# EAGLE design ramboard (EAGLE 6.6.0)
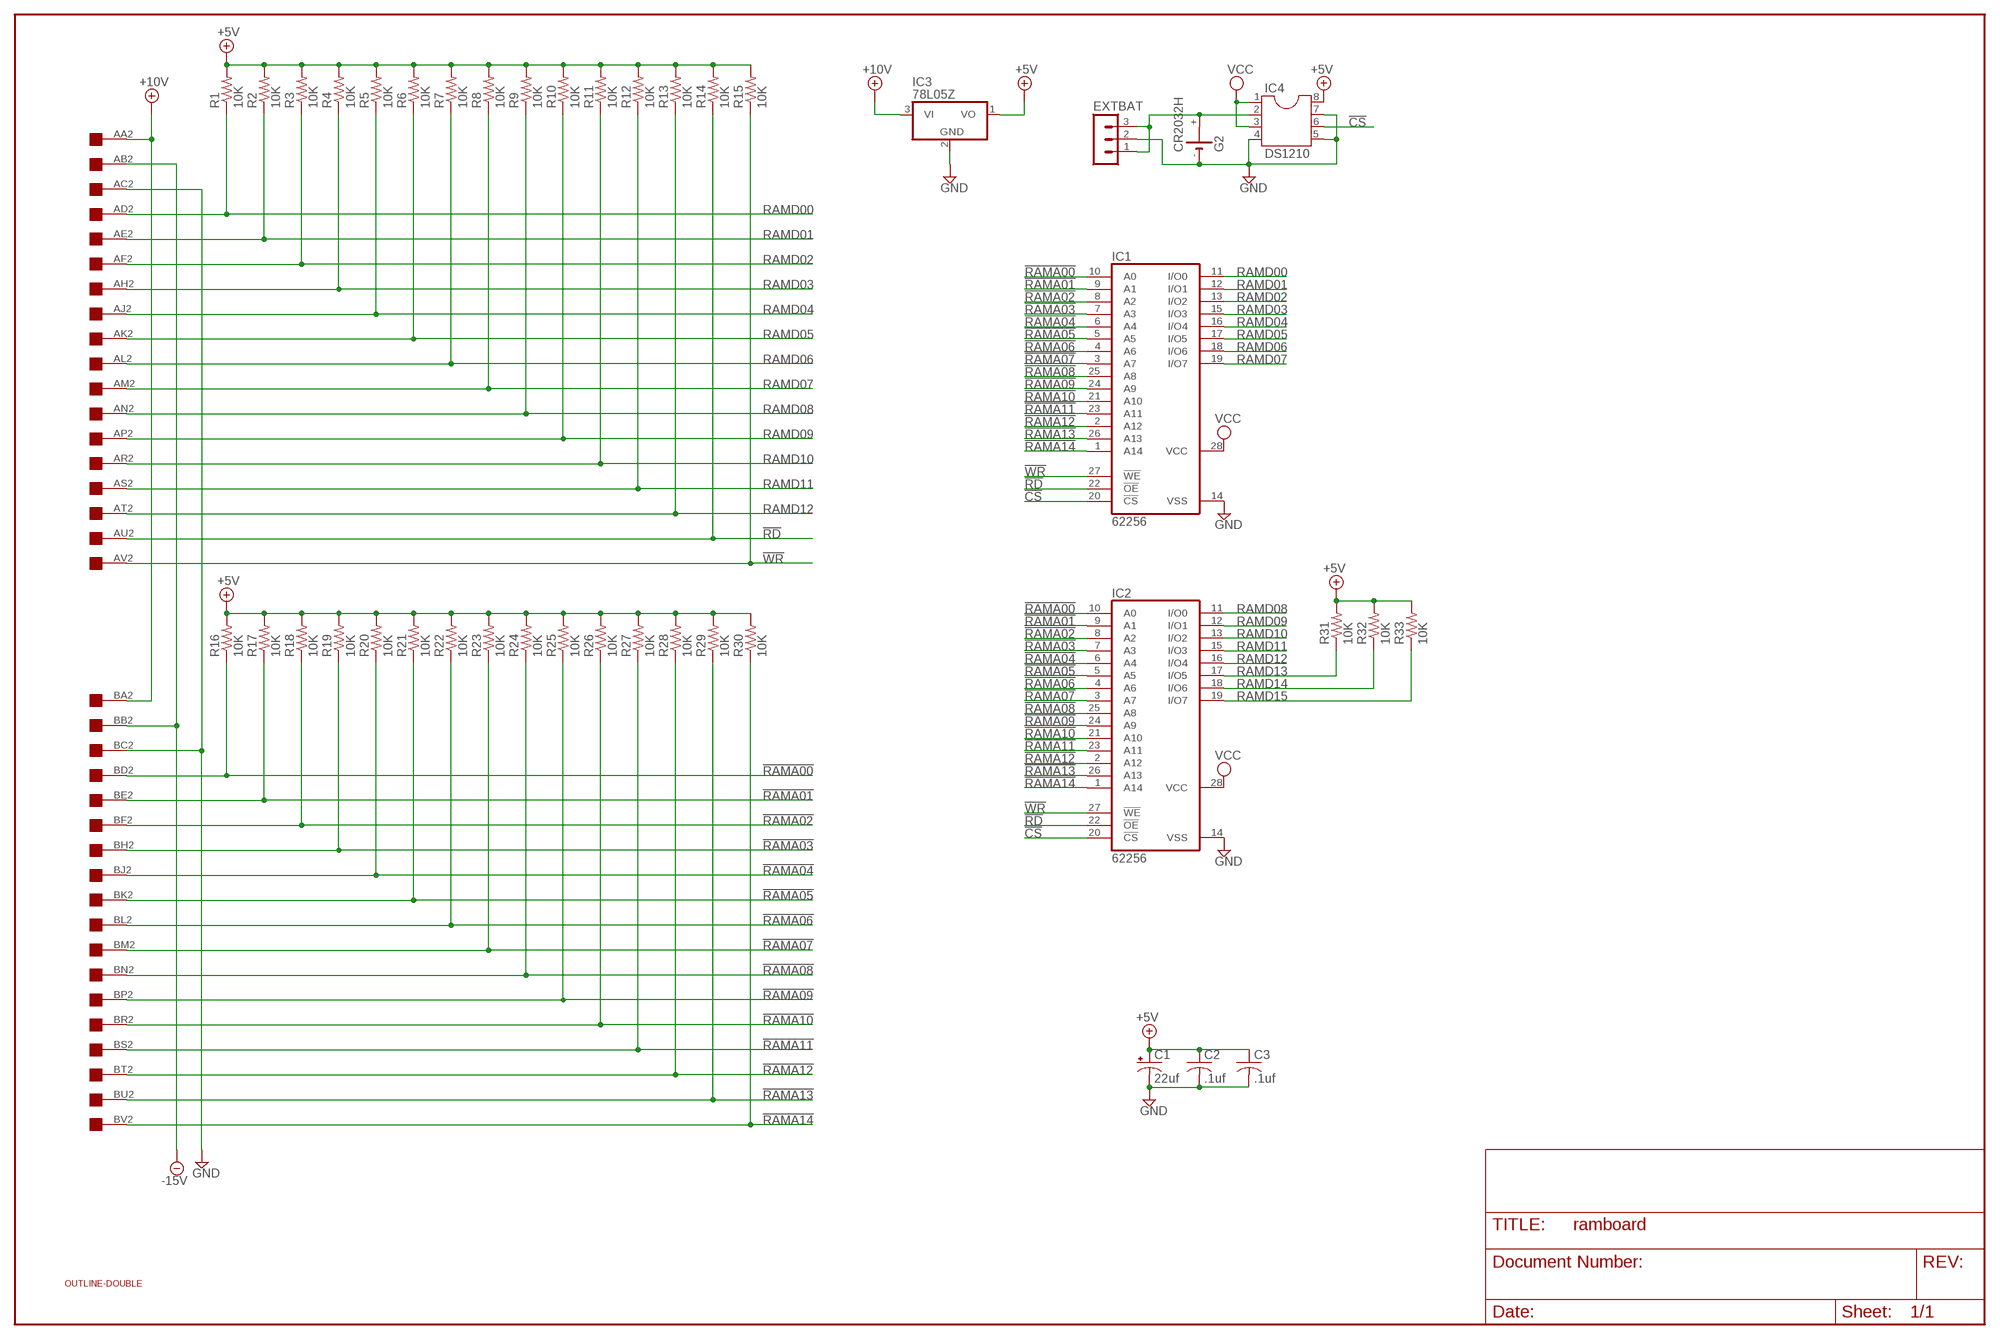
[diagram p0: schematic, sheet 1]

## Parts
C1  22uf  CPOL-USE22-6AXIAL  [E22-6]
C2  .1uf  C-US050-025X075  [C050-025X075]
C3  .1uf  C-US050-025X075  [C050-025X075]
EXTBAT  MA03-1  [MA03-1]
G2  CR2032H  [CR2032H]
IC1  62256  62256P  [DIL28-6]
IC2  62256  62256P  [DIL28-6]
IC3  78L05Z  [TO92]
IC4  DS1210  DIL8S  [SOCKET-08]
R1  10K  R-US_0207/10  [0207/10]
R2  10K  R-US_0207/10  [0207/10]
R3  10K  R-US_0207/10  [0207/10]
R4  10K  R-US_0207/10  [0207/10]
R5  10K  R-US_0207/10  [0207/10]
R6  10K  R-US_0207/10  [0207/10]
R7  10K  R-US_0207/10  [0207/10]
R8  10K  R-US_0207/10  [0207/10]
R9  10K  R-US_0207/10  [0207/10]
R10  10K  R-US_0207/10  [0207/10]
R11  10K  R-US_0207/10  [0207/10]
R12  10K  R-US_0207/10  [0207/10]
R13  10K  R-US_0207/10  [0207/10]
R14  10K  R-US_0207/10  [0207/10]
R15  10K  R-US_0207/10  [0207/10]
R16  10K  R-US_0207/10  [0207/10]
R17  10K  R-US_0207/10  [0207/10]
R18  10K  R-US_0207/10  [0207/10]
R19  10K  R-US_0207/10  [0207/10]
R20  10K  R-US_0207/10  [0207/10]
R21  10K  R-US_0207/10  [0207/10]
R22  10K  R-US_0207/10  [0207/10]
R23  10K  R-US_0207/10  [0207/10]
R24  10K  R-US_0207/10  [0207/10]
R25  10K  R-US_0207/10  [0207/10]
R26  10K  R-US_0207/10  [0207/10]
R27  10K  R-US_0207/10  [0207/10]
R28  10K  R-US_0207/10  [0207/10]
R29  10K  R-US_0207/10  [0207/10]
R30  10K  R-US_0207/10  [0207/10]
R31  10K  R-US_0207/10  [0207/10]
R32  10K  R-US_0207/10  [0207/10]
R33  10K  R-US_0207/10  [0207/10]
U$1  OUTLINE-DOUBLE  [DOUBLE]
U$2  DOUBLE  [EDGE-CON4]

## Nets
!CS: IC1.20(!CS) IC2.20(!CS) IC4.6
!RAMA00: IC1.10(A0) IC2.10(A0) R16.1 U$2.BD2
!RAMA01: IC1.9(A1) IC2.9(A1) R17.1 U$2.BE2
!RAMA02: IC1.8(A2) IC2.8(A2) R18.1 U$2.BF2
!RAMA03: IC1.7(A3) IC2.7(A3) R19.1 U$2.BH2
!RAMA04: IC1.6(A4) IC2.6(A4) R20.1 U$2.BJ2
!RAMA05: IC1.5(A5) IC2.5(A5) R21.1 U$2.BK2
!RAMA06: IC1.4(A6) IC2.4(A6) R22.1 U$2.BL2
!RAMA07: IC1.3(A7) IC2.3(A7) R23.1 U$2.BM2
!RAMA08: IC1.25(A8) IC2.25(A8) R24.1 U$2.BN2
!RAMA09: IC1.24(A9) IC2.24(A9) R25.1 U$2.BP2
!RAMA10: IC1.21(A10) IC2.21(A10) R26.1 U$2.BR2
!RAMA11: IC1.23(A11) IC2.23(A11) R27.1 U$2.BS2
!RAMA12: IC1.2(A12) IC2.2(A12) R28.1 U$2.BT2
!RAMA13: IC1.26(A13) IC2.26(A13) R29.1 U$2.BU2
!RAMA14: IC1.1(A14) IC2.1(A14) R30.1 U$2.BV2
!RD: IC1.22(!OE) IC2.22(!OE) R14.1 U$2.AU2
!WR: IC1.27(!WE) IC2.27(!WE) R15.1 U$2.AV2
+5V: C1.+ C2.1 C3.1 IC3.1(VO) IC4.8 R1.2 R2.2 R3.2 R4.2 R5.2 R6.2 R7.2 R8.2 R9.2 R10.2 R11.2 R12.2 R13.2 R14.2 R15.2 R16.2 R17.2 R18.2 R19.2 R20.2 R21.2 R22.2 R23.2 R24.2 R25.2 R26.2 R27.2 R28.2 R29.2 R30.2 R31.2 R32.2 R33.2
+10V: IC3.3(VI) U$2.AA2 U$2.BA2
-15V: U$2.AB2 U$2.BB2
GND: C1.- C2.2 C3.2 EXTBAT.2 G2.- IC1.14(VSS) IC2.14(VSS) IC3.2(GND) IC4.4 IC4.5 IC4.7 U$2.AC2 U$2.BC2
N$1: EXTBAT.1 EXTBAT.3 G2.+ IC4.2
RAMD00: IC1.11(I/O0) R1.1 U$2.AD2
RAMD01: IC1.12(I/O1) R2.1 U$2.AE2
RAMD02: IC1.13(I/O2) R3.1 U$2.AF2
RAMD03: IC1.15(I/O3) R4.1 U$2.AH2
RAMD04: IC1.16(I/O4) R5.1 U$2.AJ2
RAMD05: IC1.17(I/O5) R6.1 U$2.AK2
RAMD06: IC1.18(I/O6) R7.1 U$2.AL2
RAMD07: IC1.19(I/O7) R8.1 U$2.AM2
RAMD08: IC2.11(I/O0) R9.1 U$2.AN2
RAMD09: IC2.12(I/O1) R10.1 U$2.AP2
RAMD10: IC2.13(I/O2) R11.1 U$2.AR2
RAMD11: IC2.15(I/O3) R12.1 U$2.AS2
RAMD12: IC2.16(I/O4) R13.1 U$2.AT2
RAMD13: IC2.17(I/O5) R31.1
RAMD14: IC2.18(I/O6) R32.1
RAMD15: IC2.19(I/O7) R33.1
VCC: IC1.28(VCC) IC2.28(VCC) IC4.1 IC4.3
Unconnected: G2.+@1(+) U$2.AA1 U$2.AB1 U$2.AC1 U$2.AD1 U$2.AE1 U$2.AF1 U$2.AH1 U$2.AJ1 U$2.AK1 U$2.AL1 U$2.AM1 U$2.AN1 U$2.AP1 U$2.AR1 U$2.AS1 U$2.AT1 U$2.AU1 U$2.AV1 U$2.BA1 U$2.BB1 U$2.BC1 U$2.BD1 U$2.BE1 U$2.BF1 U$2.BH1 U$2.BJ1 U$2.BK1 U$2.BL1 U$2.BM1 U$2.BN1 U$2.BP1 U$2.BR1 U$2.BS1 U$2.BT1 U$2.BU1 U$2.BV1

## Library data of the parts
C1 = rcl:CPOL-US: POLARIZED CAPACITOR, American symbol
C2 C3 = rcl:C-US: CAPACITOR, American symbol
EXTBAT = con-lstb:MA03-1: PIN HEADER; OC_FARNELL: unknown; OC_NEWARK: unknown
G2 = battery:CR2032H: LI BATTERY Varta
IC1 IC2 = memory-hitachi:62256P: MEMORY; OC_FARNELL: unknown; OC_NEWARK: unknown
IC3 = linear:78*: Positive VOLTAGE REGULATOR Source: http://cache.national.com/ds/LM/LM78L05.pdf http://www.fairchildsemi.com/ds/LM/LM7805.pdf
IC4 = ic-package:DIL8: Dual In Line / Socket
R1-R33 = rcl:R-US_: RESISTOR, American symbol
U$1 = dec-con:OUTLINE-*: Board outlines for DEC boards.
U$2 = dec-con:DOUBLE: Double-Height DEC board

## Board
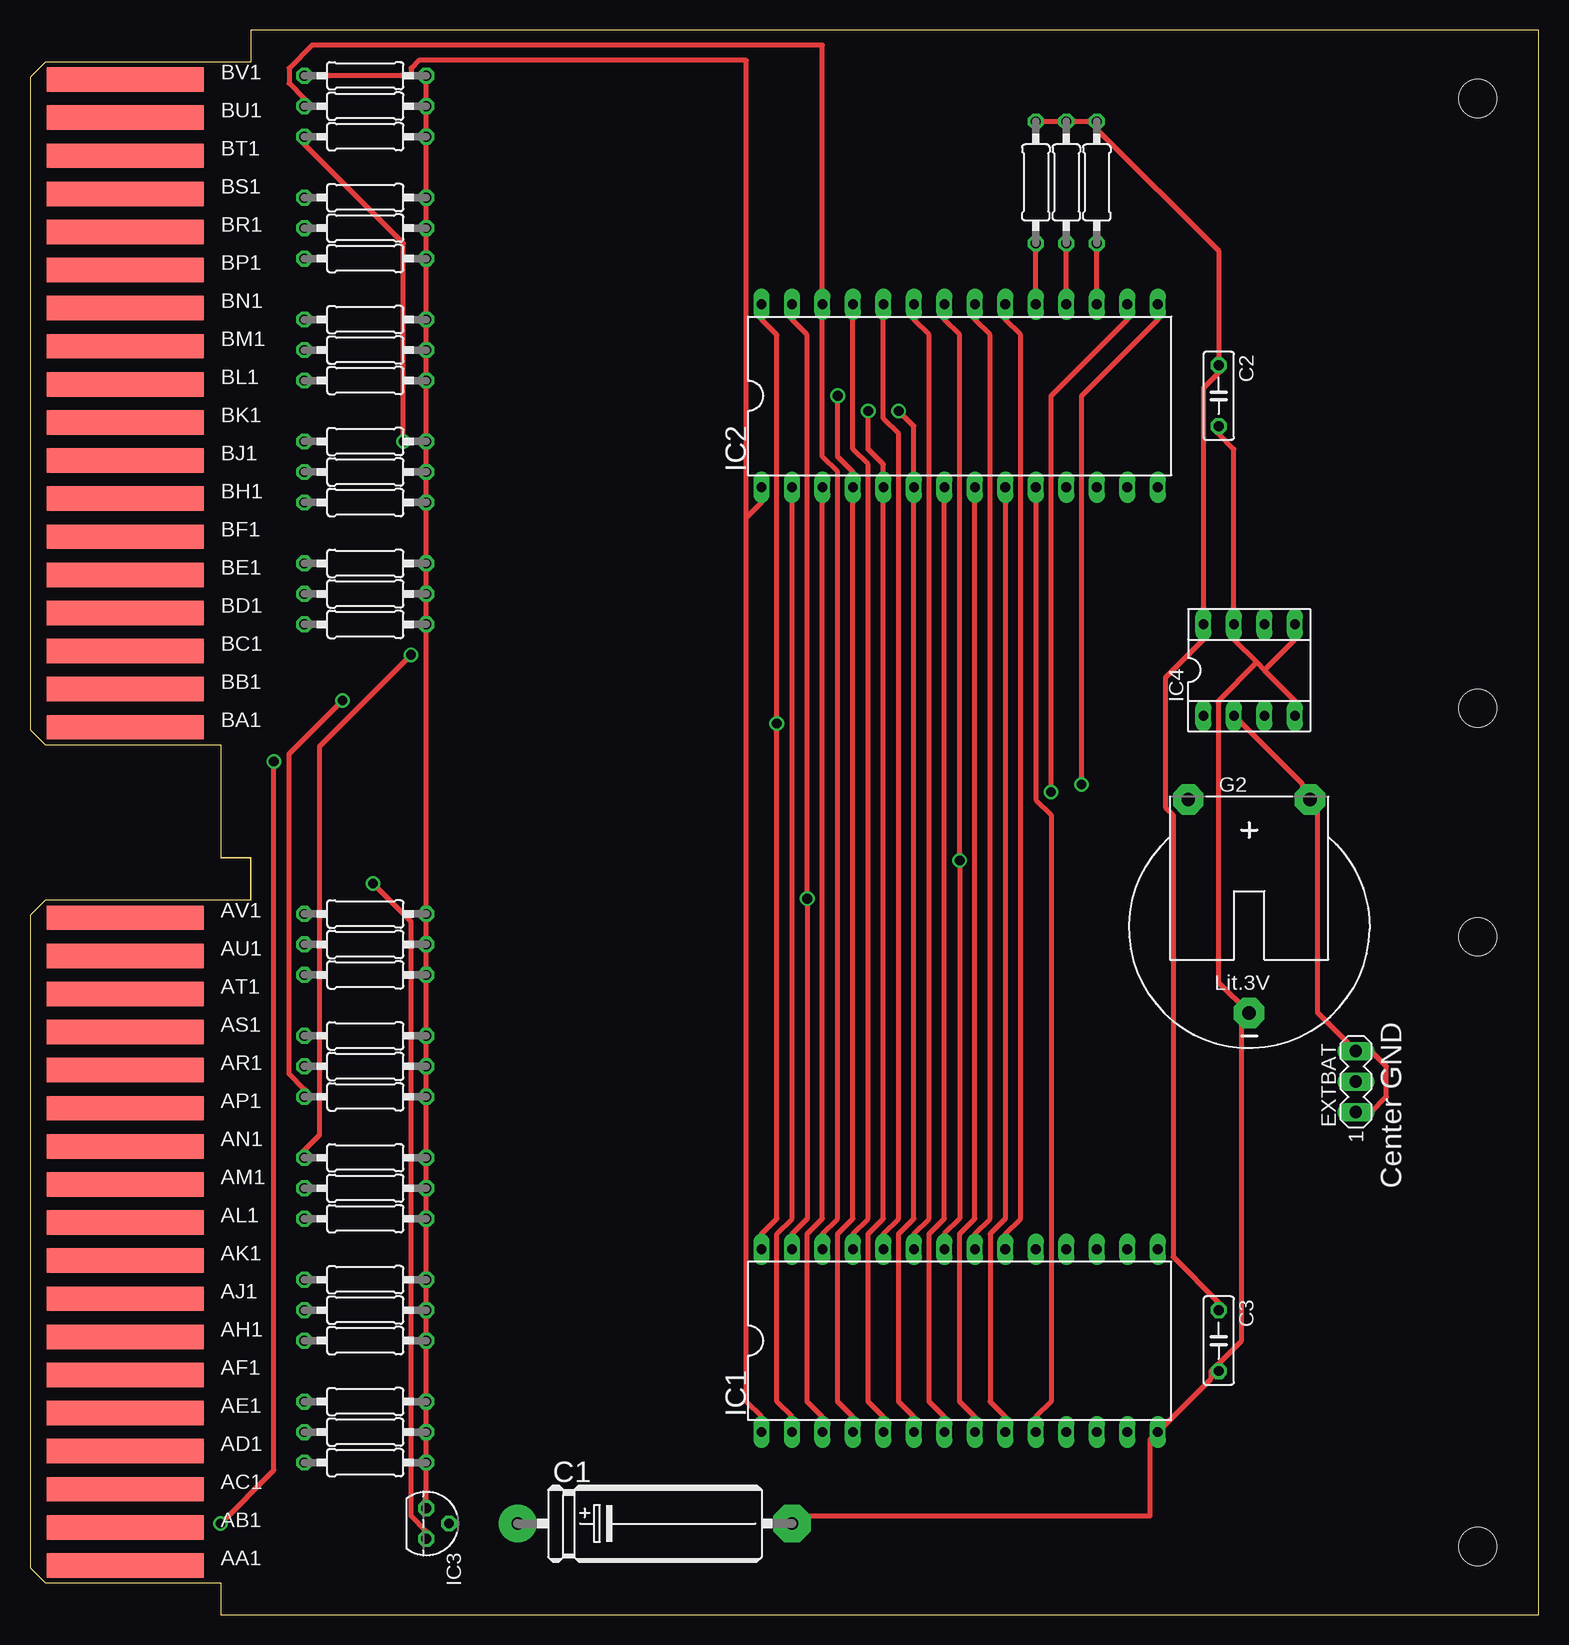
[diagram p1: board, top side]
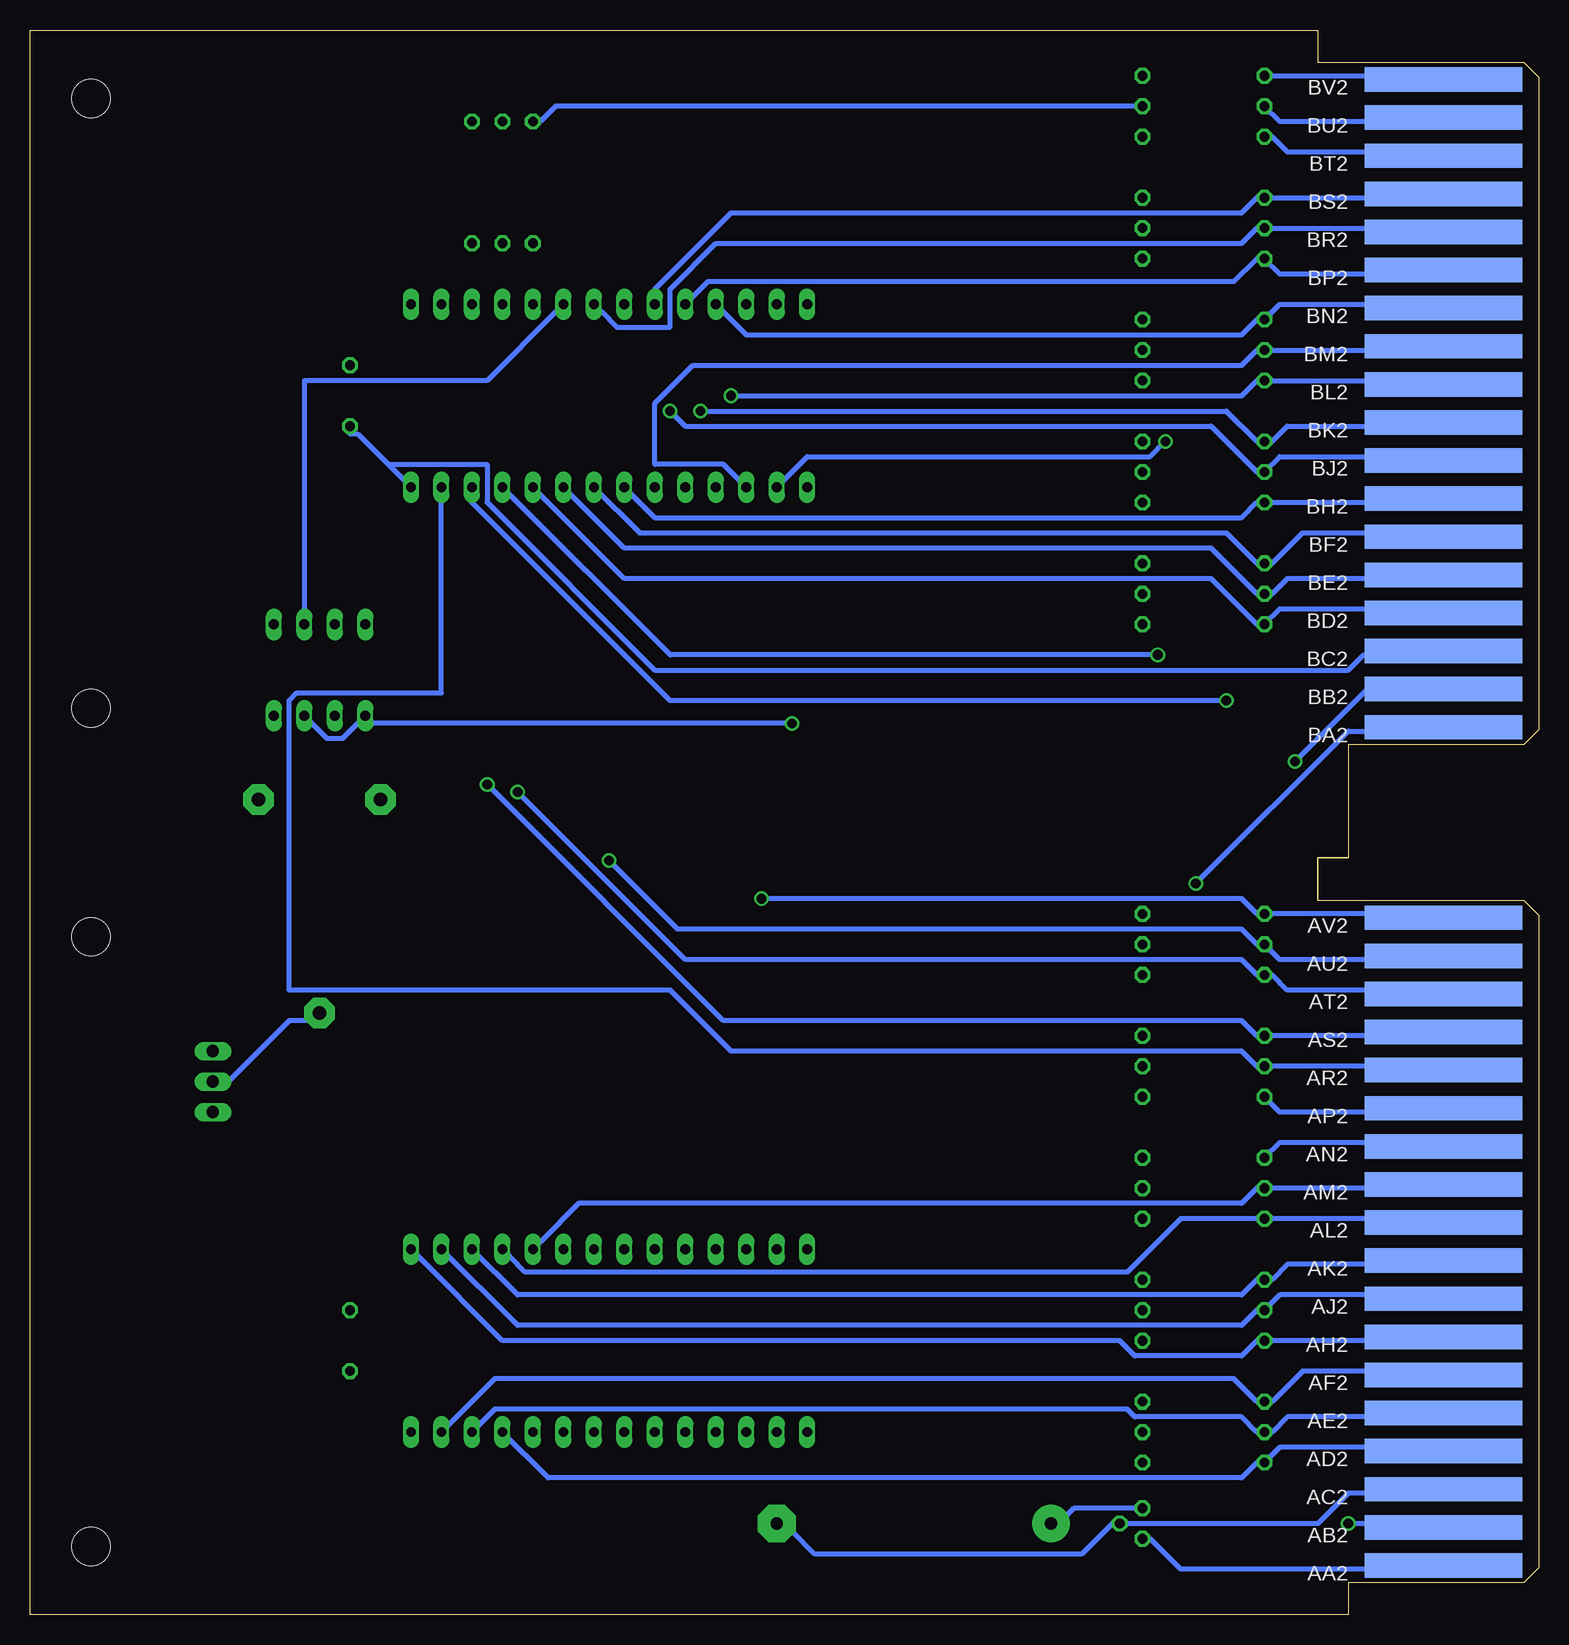
[diagram p2: board, bottom side, seen from below]

Size 125.73 x 132.08 mm. Coordinates in mm from the lower left corner, seen from the top.
Copper layers (1+16): Top 0.035mm / dielectric 1.5mm / Bottom 0.035mm
Design rules "16mils": minimum track width 16mil, minimum drill 32mil, track to track 15mil, track to pad 10mil, pad to pad 10mil, via to via 10mil, smd to smd 10mil, copper to edge 13mil, drill to drill 10mil, minimum pad ring 10mil, minimum via ring 8mil, stop-mask expansion 0mil, vias tented up to drill 0mil, thermal gap 10mil

### Footprints (pad centres in the part's own frame; a part is rotated, then mirrored left to right if it is on the bottom)
E22-6 = drill 1.016 pad 3.15: + -11.43,0 | drill 1.016 pad 3.15 octagon: - 11.43,0
C050-025X075 = drill 0.813 octagon: 1 -2.54,0; 2 2.54,0
MA03-1 = drill 1.016 long: 1 -2.54,0; 2 0,0; 3 2.54,0
CR2032H = drill 1.118 pad 2.54 octagon: + 5.08,10.795; +@1 -5.08,10.795; - 0,-6.985
DIL28-6 = drill 0.813 long: 1 -16.51,-7.62; 2 -13.97,-7.62; 3 -11.43,-7.62; 4 -8.89,-7.62; 5 -6.35,-7.62; 6 -3.81,-7.62; 7 -1.27,-7.62; 8 1.27,-7.62; 9 3.81,-7.62; 10 6.35,-7.62; 11 8.89,-7.62; 12 11.43,-7.62; 13 13.97,-7.62; 14 16.51,-7.62; 15 16.51,7.62; 16 13.97,7.62; 17 11.43,7.62; 18 8.89,7.62; 19 6.35,7.62; 20 3.81,7.62; 21 1.27,7.62; 22 -1.27,7.62; 23 -3.81,7.62; 24 -6.35,7.62; 25 -8.89,7.62; 26 -11.43,7.62; 27 -13.97,7.62; 28 -16.51,7.62
TO92 = drill 0.813 octagon: 1 -1.27,0; 2 0,1.905; 3 1.27,0
SOCKET-08 = drill 0.813 long: 1 -3.81,-3.81; 2 -1.27,-3.81; 3 1.27,-3.81; 4 3.81,-3.81; 5 3.81,3.81; 6 1.27,3.81; 7 -1.27,3.81; 8 -3.81,3.81
0207/10 = drill 0.813 octagon: 1 -5.08,0; 2 5.08,0
DOUBLE = hole 3.175: 120.65,56.515; 120.65,5.715; 120.65,75.565; 120.65,126.365
EDGE-CON4 = smd 13.106 x 2.032: AA1 7.938,4.128; AB1 7.938,7.303; AC1 7.938,10.477; AD1 7.938,13.652; AE1 7.938,16.828; AF1 7.938,20.003; AH1 7.938,23.177; AJ1 7.938,26.352; AK1 7.938,29.527; AL1 7.938,32.703; AM1 7.938,35.877; AN1 7.938,39.053; AP1 7.938,42.227; AR1 7.938,45.403; AS1 7.938,48.578; AT1 7.938,51.752; AU1 7.938,54.928; AV1 7.938,58.102; BA1 7.938,73.978; BB1 7.938,77.153; BC1 7.938,80.328; BD1 7.938,83.502; BE1 7.938,86.677; BF1 7.938,89.853; BH1 7.938,93.028; BJ1 7.938,96.203; BK1 7.938,99.377; BL1 7.938,102.552; BM1 7.938,105.728; BN1 7.938,108.903; BP1 7.938,112.078; BR1 7.938,115.252; BS1 7.938,118.427; BT1 7.938,121.603; BU1 7.938,124.778; BV1 7.938,127.953 | smd 13.106 x 2.032 bottom: AA2 7.938,4.128; AB2 7.938,7.303; AC2 7.938,10.477; AD2 7.938,13.652; AE2 7.938,16.828; AF2 7.938,20.003; AH2 7.938,23.177; AJ2 7.938,26.352; AK2 7.938,29.527; AL2 7.938,32.703; AM2 7.938,35.877; AN2 7.938,39.053; AP2 7.938,42.227; AR2 7.938,45.403; AS2 7.938,48.578; AT2 7.938,51.752; AU2 7.938,54.928; AV2 7.938,58.102; BA2 7.938,73.978; BB2 7.938,77.153; BC2 7.938,80.328; BD2 7.938,83.502; BE2 7.938,86.677; BF2 7.938,89.853; BH2 7.938,93.028; BJ2 7.938,96.203; BK2 7.938,99.377; BL2 7.938,102.552; BM2 7.938,105.728; BN2 7.938,108.903; BP2 7.938,112.078; BR2 7.938,115.252; BS2 7.938,118.427; BT2 7.938,121.603; BU2 7.938,124.778; BV2 7.938,127.953

### Placement (x,y rotation side)
C1  52.07,7.62 0 top
C2  99.06,101.6 270 top
C3  99.06,22.86 270 top
EXTBAT  110.49,44.45 90 top
G2  101.6,57.15 0 top
IC1  77.47,22.86 0 top
IC2  77.47,101.6 0 top
IC3  33.02,7.62 270 top
IC4  101.6,78.74 0 top
R1  27.94,12.7 0 top
R2  27.94,15.24 0 top
R3  27.94,17.78 0 top
R4  27.94,22.86 0 top
R5  27.94,25.4 0 top
R6  27.94,27.94 0 top
R7  27.94,33.02 0 top
R8  27.94,35.56 0 top
R9  27.94,38.1 0 top
R10  27.94,43.18 0 top
R11  27.94,45.72 0 top
R12  27.94,48.26 0 top
R13  27.94,53.34 0 top
R14  27.94,55.88 0 top
R15  27.94,58.42 0 top
R16  27.94,82.55 0 top
R17  27.94,85.09 0 top
R18  27.94,87.63 0 top
R19  27.94,92.71 0 top
R20  27.94,95.25 0 top
R21  27.94,97.79 0 top
R22  27.94,102.87 0 top
R23  27.94,105.41 0 top
R24  27.94,107.95 0 top
R25  27.94,113.03 0 top
R26  27.94,115.57 0 top
R27  27.94,118.11 0 top
R28  27.94,123.19 0 top
R29  27.94,125.73 0 top
R30  27.94,128.27 0 top
R31  88.9,119.38 90 top
R32  86.36,119.38 90 top
R33  83.82,119.38 90 top
U$1  0,0 0 top
U$2  0,0 0 top

### Tracks (layer width: path | path; a pad name or v marks a point on that pad's centre or on a via)
!CS
  Top 0.406: IC1.20 81.28,31.75 82.55,33.02 82.55,106.68 81.28,107.95 IC2.20
  Bottom 0.406: IC4.6 102.87,83.82 102.87,102.87 87.63,102.87 81.92,108.58 IC2.20
!RAMA00
  Top 0.406: IC2.10 83.82,67.94 85.09,66.67 85.09,17.78 83.82,16.51 IC1.10
  Bottom 0.406: U$2.BD2 13.34,83.82 21.59,83.82 R16.1 23.5,82.55 27.31,86.36 76.2,86.36 IC2.10
!RAMA01
  Top 0.406: IC2.9 81.28,33.02 80.01,31.75 80.01,17.78 81.28,16.51 IC1.9
  Bottom 0.406: U$2.BE2 13.34,86.36 20.96,86.36 22.23,85.09 R17.1 23.5,85.09 27.31,88.9 76.2,88.9 IC2.9
!RAMA02
  Top 0.406: IC2.8 78.74,33.02 77.47,31.75 77.47,17.78 78.74,16.51 IC1.8
  Bottom 0.406: U$2.BF2 12.7,90.17 19.69,90.17 22.23,87.63 R18.1 23.5,87.63 26.04,90.17 74.93,90.17 IC2.8
!RAMA03
  Top 0.406: IC1.7 76.2,16.51 74.93,17.78 74.93,31.75 76.2,33.02 76.2,92.71 IC2.7
  Bottom 0.406: U$2.BH2 13.97,92.71 22.23,92.71 R19.1 23.5,92.71 24.77,91.44 73.66,91.44 75.57,93.34 IC2.7
!RAMA04  (via drill 0.81)
  Top 0.406: IC1.6 73.66,16.51 72.39,17.78 72.39,31.75 73.66,33.02 IC2.6 73.66,99.06 v72.39,100.33
  Bottom 0.406: U$2.BJ2 13.34,96.52 21.59,96.52 R20.1 23.5,95.25 27.31,99.06 71.12,99.06 v72.39,100.33
!RAMA05  (via drill 0.81)
  Top 0.406: IC1.5 71.12,16.51 69.85,17.78 69.85,31.75 71.12,33.02 IC2.5 71.12,95.89 69.85,97.16 v69.85,100.33
  Bottom 0.406: U$2.BK2 12.7,99.06 20.96,99.06 22.23,97.79 R21.1 23.5,97.79 26.04,100.33 v69.85,100.33
!RAMA06  (via drill 0.81)
  Top 0.406: IC1.4 68.58,16.51 67.31,17.78 67.31,31.75 68.58,33.02 68.58,92.71 IC2.4 68.58,95.25 67.31,96.52 v67.31,101.6
  Bottom 0.406: U$2.BL2 13.97,102.87 22.23,102.87 R22.1 23.5,102.87 24.77,101.6 v67.31,101.6
!RAMA07
  Top 0.406: IC1.3 66.04,16.51 64.77,17.78 64.77,31.75 66.04,33.02 66.04,92.71 IC2.3
  Bottom 0.406: U$2.BM2 13.97,105.41 22.23,105.41 R23.1 23.5,105.41 24.77,104.14 70.49,104.14 73.66,100.97 73.66,95.89 67.95,95.89 66.68,94.61 IC2.3
!RAMA08
  Top 0.406: IC2.25 68.58,97.16 69.85,95.89 69.85,33.02 68.58,31.75 IC1.25
  Bottom 0.406: U$2.BN2 13.34,109.22 21.59,109.22 R24.1 23.5,107.95 24.77,106.68 66.04,106.68 IC2.25
!RAMA09
  Top 0.406: IC2.24 71.12,99.69 72.39,98.42 72.39,33.02 71.12,31.75 IC1.24
  Bottom 0.406: U$2.BP2 13.34,111.76 21.59,111.76 R25.1 23.5,113.03 25.4,111.12 69.22,111.12 IC2.24
!RAMA10
  Top 0.406: IC1.21 78.74,31.75 80.01,33.02 80.01,106.68 78.74,107.95 IC2.21
  Bottom 0.406: U$2.BR2 13.97,115.57 22.23,115.57 R26.1 23.5,115.57 24.77,114.3 68.58,114.3 72.39,110.49 72.39,107.31 76.84,107.31 78.11,108.58 IC2.21
!RAMA11
  Top 0.406: IC1.23 73.66,31.75 74.93,33.02 74.93,106.68 73.66,107.95 IC2.23
  Bottom 0.406: U$2.BS2 13.97,118.11 22.23,118.11 R27.1 23.5,118.11 24.77,116.84 67.31,116.84 73.66,110.49 IC2.23
!RAMA12  (via drill 0.81)
  Top 0.406: IC2.2 63.5,33.02 62.23,31.75 62.23,17.78 63.5,16.51 IC1.2 | v31.12,97.79 31.12,114.3 22.86,122.56 R28.1
  Bottom 0.406: R28.1 22.23,123.19 20.96,121.92 13.34,121.92 U$2.BT2 | v31.12,97.79 32.39,96.52 60.96,96.52 IC2.2
!RAMA13
  Top 0.406: IC1.26 66.04,31.75 67.31,33.02 67.31,95.25 66.04,96.52 IC2.26 66.04,130.81 23.5,130.81 21.59,128.91 21.59,127.64 22.86,126.36 R29.1
  Bottom 0.406: R29.1 21.59,124.46 13.34,124.46 U$2.BU2
!RAMA14
  Top 0.406: 59.69,91.44 59.69,17.78 60.96,16.51 IC1.1 | 59.69,91.44 60.96,92.71 IC2.1 | 59.69,91.44 59.69,129.54 32.39,129.54 31.75,128.91 31.75,128.27 23.5,128.27 R30.1
  Bottom 0.406: R30.1 22.23,128.27 13.97,128.27 U$2.BV2
!RD  (via drill 0.81)
  Top 0.406: IC1.22 76.2,31.75 77.47,33.02 v77.47,62.87 77.47,106.68 76.2,107.95 IC2.22
  Bottom 0.406: U$2.AU2 13.34,54.61 21.59,54.61 R14.1 23.5,55.88 24.77,57.15 71.76,57.15 v77.47,62.87
!WR  (via drill 0.81)
  Top 0.406: IC1.27 63.5,31.75 64.77,33.02 v64.77,59.69 64.77,106.68 63.5,107.95 IC2.27
  Bottom 0.406: U$2.AV2 13.97,58.42 22.23,58.42 R15.1 23.5,58.42 24.77,59.69 v64.77,59.69
+5V
  Top 0.406: R33.2 84.46,124.46 85.73,124.46 R32.2 87,124.46 88.27,124.46 R31.2 88.9,123.83 99.06,113.67 99.06,104.78 C2.1 99.06,103.5 97.79,102.23 97.79,83.82 IC4.8 97.79,81.28 94.62,78.11 94.62,67.31 95.25,66.67 95.25,29.84 99.06,26.04 C3.1 | R30.2 33.02,127.64 33.02,126.36 R29.2 33.02,125.09 33.02,123.83 R28.2 33.02,122.56 33.02,118.75 R27.2 33.02,117.47 33.02,116.2 R26.2 33.02,114.94 33.02,113.67 R25.2 33.02,112.39 33.02,108.58 R24.2 33.02,107.31 33.02,106.05 R23.2 33.02,104.78 33.02,103.5 R22.2 33.02,102.23 33.02,98.42 R21.2 33.02,97.16 33.02,95.89 R20.2 33.02,94.61 33.02,93.34 R19.2 33.02,92.08 33.02,88.27 R18.2 33.02,87 33.02,85.72 R17.2 33.02,84.45 33.02,83.19 R16.2 33.02,81.92 33.02,59.05 R15.2 33.02,57.78 33.02,56.52 R14.2 33.02,55.24 33.02,53.98 R13.2 33.02,52.7 33.02,48.9 R12.2 33.02,47.62 33.02,46.35 R11.2 33.02,45.09 33.02,43.81 R10.2 33.02,42.55 33.02,38.73 R9.2 33.02,37.47 33.02,36.2 R8.2 33.02,34.92 33.02,33.66 R7.2 33.02,32.38 33.02,28.57 R6.2 33.02,27.3 33.02,26.04 R5.2 33.02,24.77 33.02,23.5 R4.2 33.02,22.23 33.02,18.41 R3.2 33.02,17.14 33.02,15.88 R2.2 33.02,14.61 33.02,13.34 R1.2 33.02,12.06 33.02,9.53 IC3.1
  Bottom 0.406: C1.+ 39.37,8.26 38.74,8.89 33.66,8.89 IC3.1 | R33.2 83.19,124.46 81.92,125.73 33.66,125.73 R29.2
+10V  (via drill 0.81)
  Top 0.406: v28.58,60.96 31.75,57.78 31.75,8.26 33.02,6.99 IC3.3
  Bottom 0.406: IC3.3 32.39,6.35 29.85,3.81 12.7,3.81 U$2.AA2 | v28.58,60.96 15.88,73.66 13.97,73.66 U$2.BA2
-15V  (via drill 0.81)
  Top 0.406: v15.88,7.62 20.32,12.06 v20.32,71.12
  Bottom 0.406: v15.88,7.62 13.97,7.62 U$2.AB2 | v20.32,71.12 13.97,77.47 12.7,77.47 U$2.BB2
GND
  Top 0.406: 102.87,78.74 105.41,76.2 IC4.4 | 102.24,79.38 102.87,78.74 | 102.24,79.38 100.33,81.28 IC4.7 100.33,97.16 99.06,98.42 C2.2 | 102.87,78.74 105.41,81.28 IC4.5 | C1.- 64.77,8.26 93.35,8.26 93.35,14.61 IC1.14 98.43,19.68 98.43,20.32 C3.2 99.06,20.95 100.97,22.86 100.97,49.53 G2.- 99.06,52.7 99.06,76.2 102.24,79.38
  Bottom 0.406: 95.89,95.89 98.43,98.42 99.06,98.42 C2.2 | 95.89,95.89 IC2.14 | 95.89,95.89 87.63,95.89 87.63,92.71 73.66,78.74 15.88,78.74 14.61,80.01 U$2.BC2 | U$2.AC2 13.97,10.16 15.88,10.16 18.42,7.62 IC3.2 35.56,7.62 38.1,5.08 60.33,5.08 62.23,6.99 C1.- | EXTBAT.2 109.22,44.45 104.14,49.53 102.24,49.53 G2.-
N$1
  Top 0.406: EXTBAT.1 111.76,41.91 113.03,43.18 113.03,45.72 111.76,46.99 EXTBAT.3 109.86,47.62 107.32,50.16 107.32,67.31 G2.+ 106.05,68.58 106.05,69.22 100.97,74.3 IC4.2
RAMD00
  Bottom 0.406: U$2.AD2 13.34,13.97 21.59,13.97 R1.1 23.5,12.7 24.77,11.43 82.55,11.43 IC1.11
RAMD01
  Bottom 0.406: U$2.AE2 13.34,16.51 20.96,16.51 22.23,15.24 R2.1 23.5,15.24 24.77,16.51 33.66,16.51 34.29,17.14 87,17.14 IC1.12
RAMD02
  Bottom 0.406: U$2.AF2 12.7,20.32 19.69,20.32 22.23,17.78 R3.1 23.5,17.78 25.4,19.68 87,19.68 IC1.13
RAMD03
  Bottom 0.406: U$2.AH2 13.97,22.86 22.23,22.86 R4.1 23.5,22.86 24.77,21.59 33.66,21.59 34.93,22.86 86.36,22.86 93.35,29.84 IC1.15
RAMD04
  Bottom 0.406: U$2.AJ2 13.34,26.67 21.59,26.67 R5.1 23.5,25.4 24.77,24.13 85.09,24.13 IC1.16
RAMD05
  Bottom 0.406: U$2.AK2 13.34,29.21 20.96,29.21 22.23,27.94 R6.1 23.5,27.94 24.77,26.67 85.09,26.67 IC1.17
RAMD06
  Bottom 0.406: U$2.AL2 13.97,33.02 22.23,33.02 R7.1 23.5,33.02 29.85,33.02 34.29,28.57 84.46,28.57 85.73,29.84 IC1.18
RAMD07
  Bottom 0.406: U$2.AM2 13.97,35.56 22.23,35.56 R8.1 23.5,35.56 24.77,34.29 80.01,34.29 83.19,31.11 IC1.19
RAMD08  (via drill 0.81)
  Top 0.406: v31.75,80.01 24.13,72.39 24.13,40.01 22.86,38.73 R9.1
  Bottom 0.406: R9.1 21.59,39.37 13.97,39.37 U$2.AN2 | IC2.11 72.39,80.01 v31.75,80.01
RAMD09  (via drill 0.81)
  Top 0.406: v26.04,76.2 21.59,71.75 21.59,45.09 22.86,43.81 R10.1
  Bottom 0.406: R10.1 21.59,41.91 13.34,41.91 U$2.AP2 | v26.04,76.2 72.39,76.2 88.9,92.71 IC2.12
RAMD10
  Bottom 0.406: U$2.AR2 13.97,45.72 22.23,45.72 R11.1 23.5,45.72 24.77,46.99 67.31,46.99 72.39,52.07 104.14,52.07 104.14,76.2 103.51,76.83 91.44,76.83 91.44,92.71 IC2.13
RAMD11  (via drill 0.81)
  Top 0.406: v87.63,69.22 87.63,101.6 93.98,107.95 IC2.15
  Bottom 0.406: U$2.AS2 13.97,48.26 22.23,48.26 R12.1 23.5,48.26 24.77,49.53 67.95,49.53 v87.63,69.22
RAMD12  (via drill 0.81)
  Top 0.406: v85.09,68.58 85.09,101.6 91.44,107.95 IC2.16
  Bottom 0.406: U$2.AT2 13.34,52.07 20.96,52.07 22.23,53.34 R13.1 23.5,53.34 24.77,54.61 71.12,54.61 v85.09,68.58
RAMD13
  Top 0.406: IC2.17 88.9,110.49 88.9,113.67 R31.1
RAMD14
  Top 0.406: IC2.18 86.36,110.49 86.36,113.67 R32.1
RAMD15
  Top 0.406: IC2.19 83.82,110.49 83.82,113.67 R33.1
VCC  (via drill 0.81)
  Top 0.406: IC1.28 60.96,31.75 62.23,33.02 v62.23,74.3 62.23,106.68 60.96,107.95 IC2.28
  Bottom 0.406: IC4.3 102.24,74.3 100.97,73.03 99.7,73.03 98.43,74.3 IC4.1 97.16,74.3 v62.23,74.3

### Text on the board
tPlace: Center GND